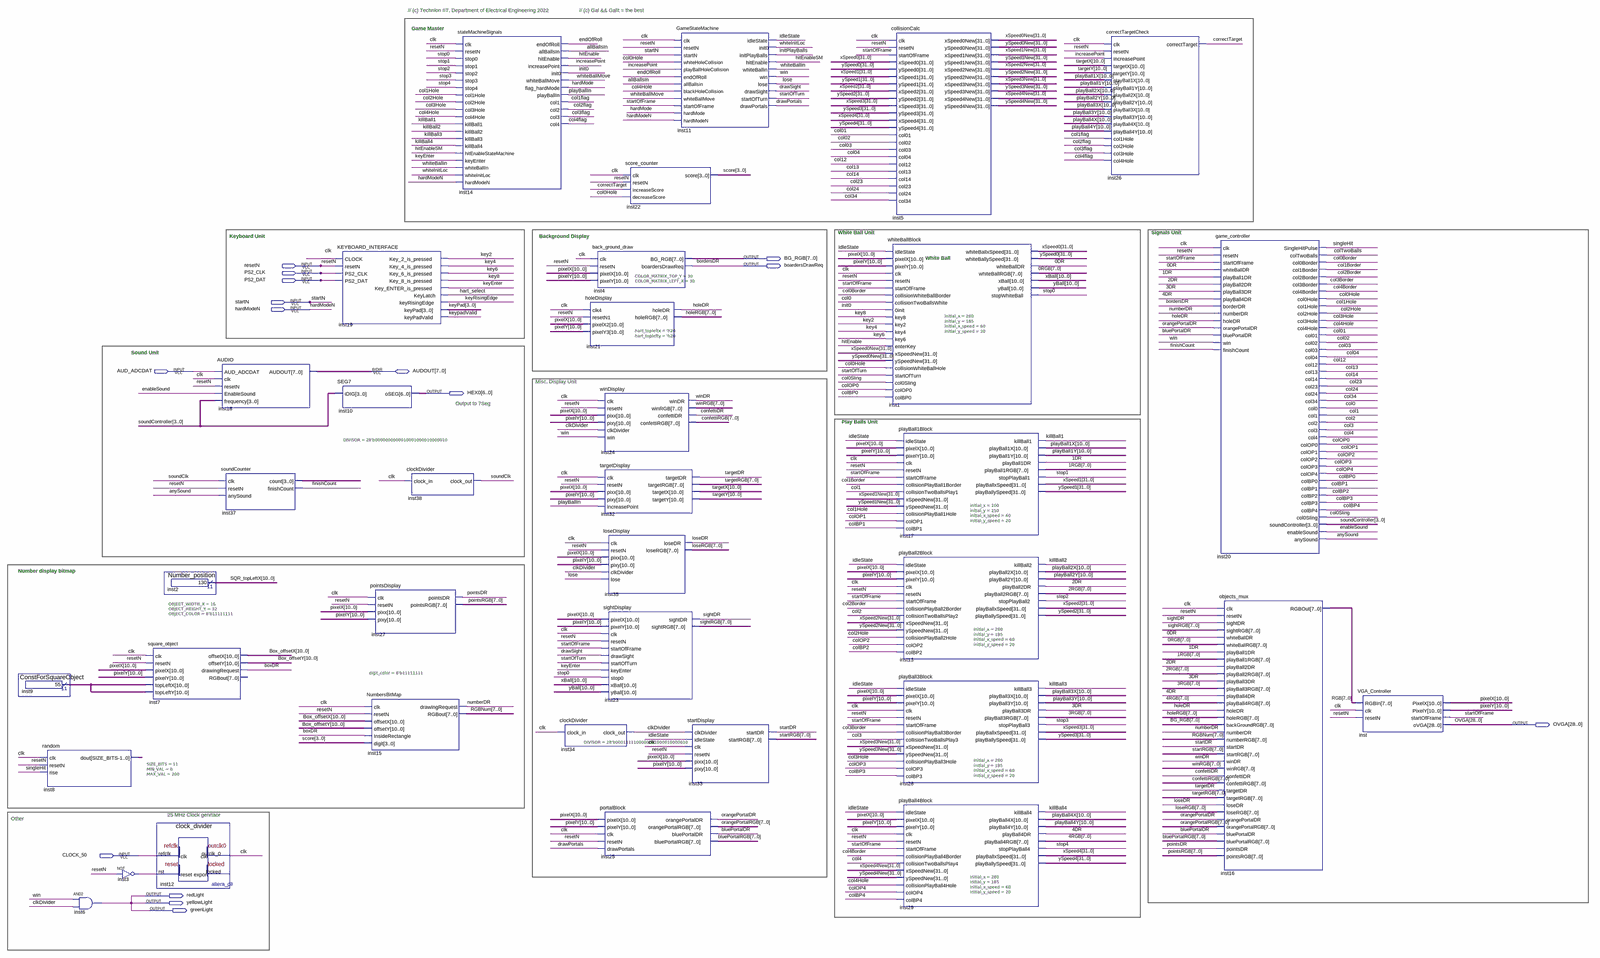
[diagram p0: schematic sheet, whole]
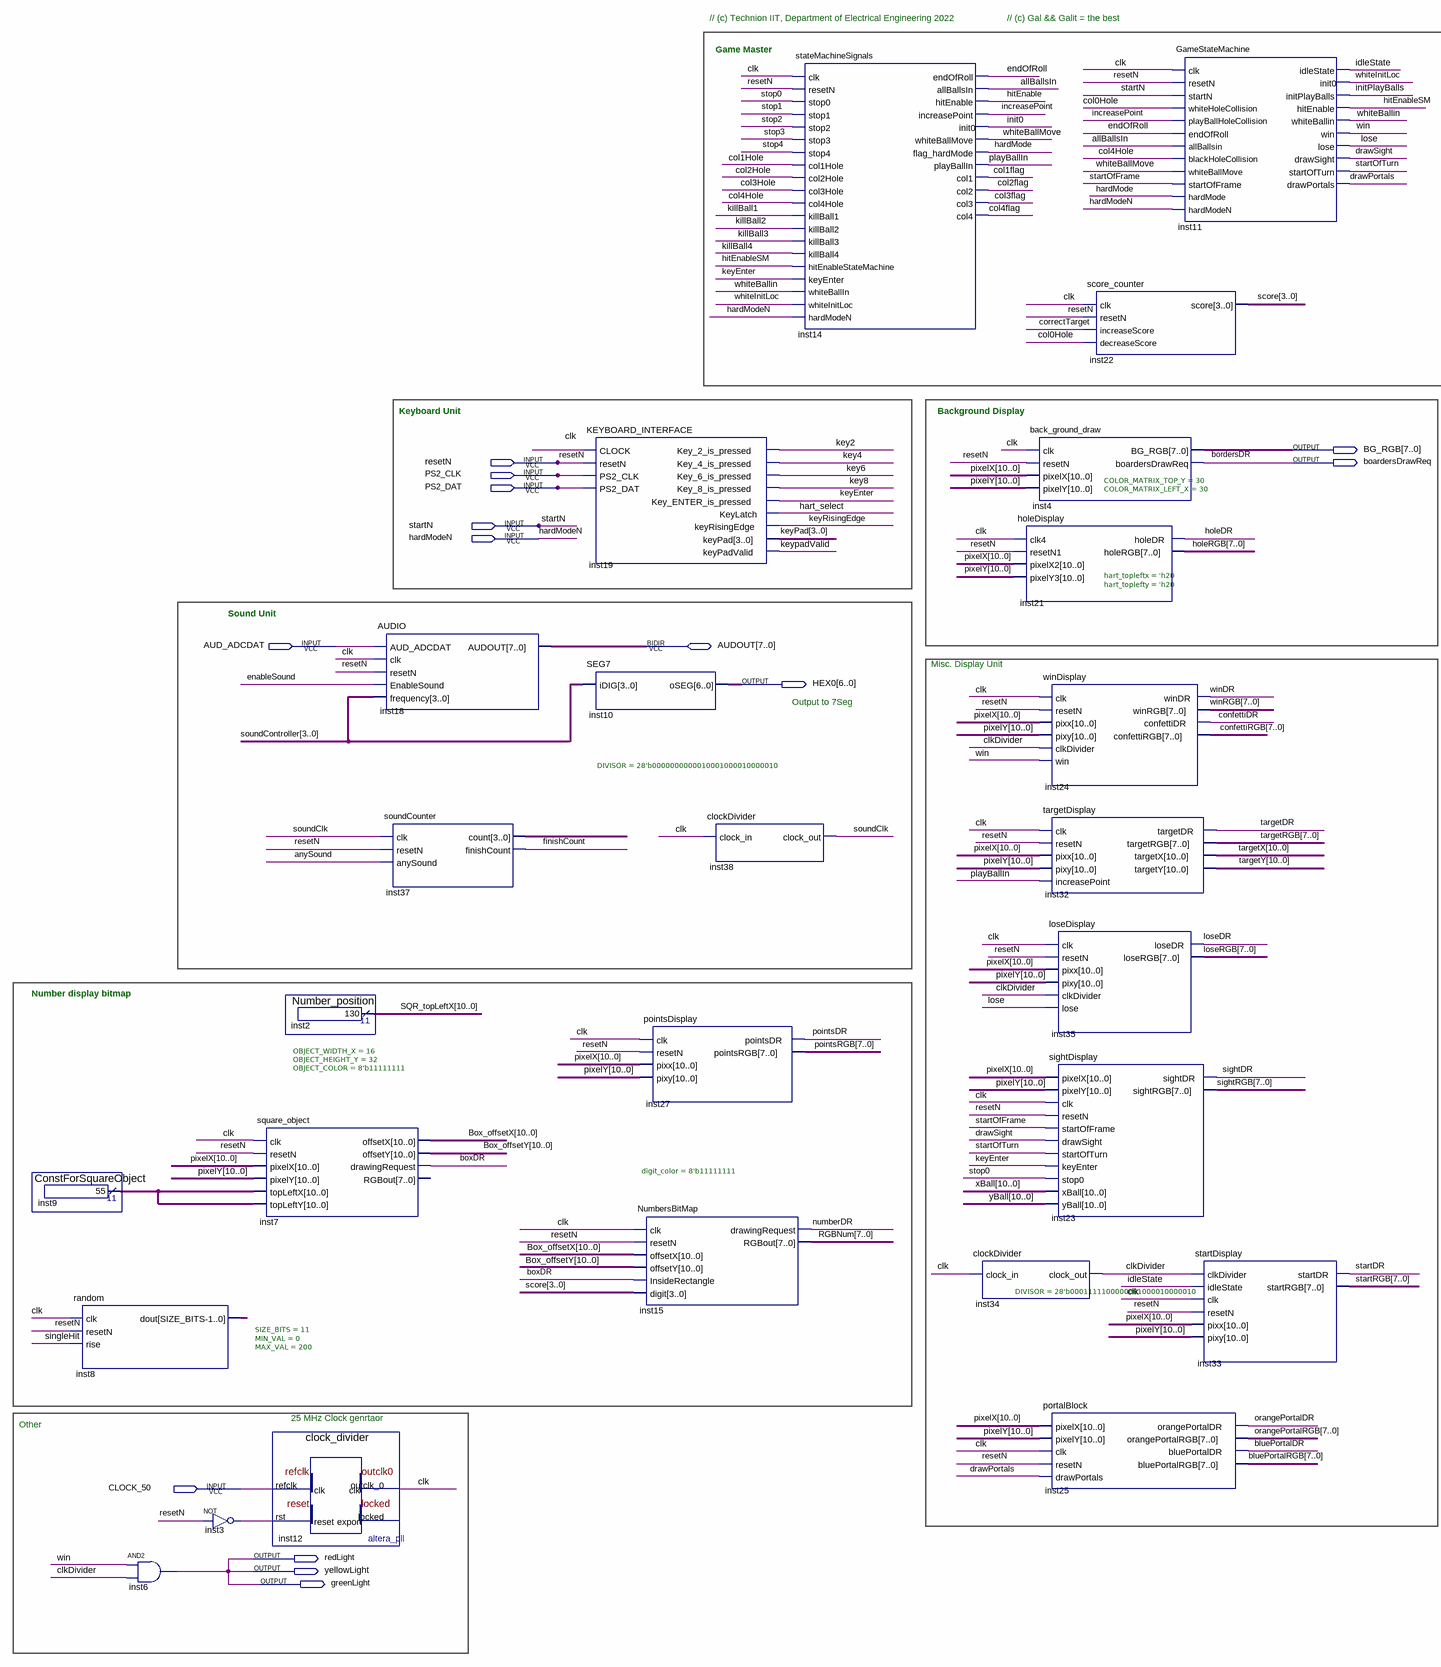
[diagram p1: schematic sheet, left part]
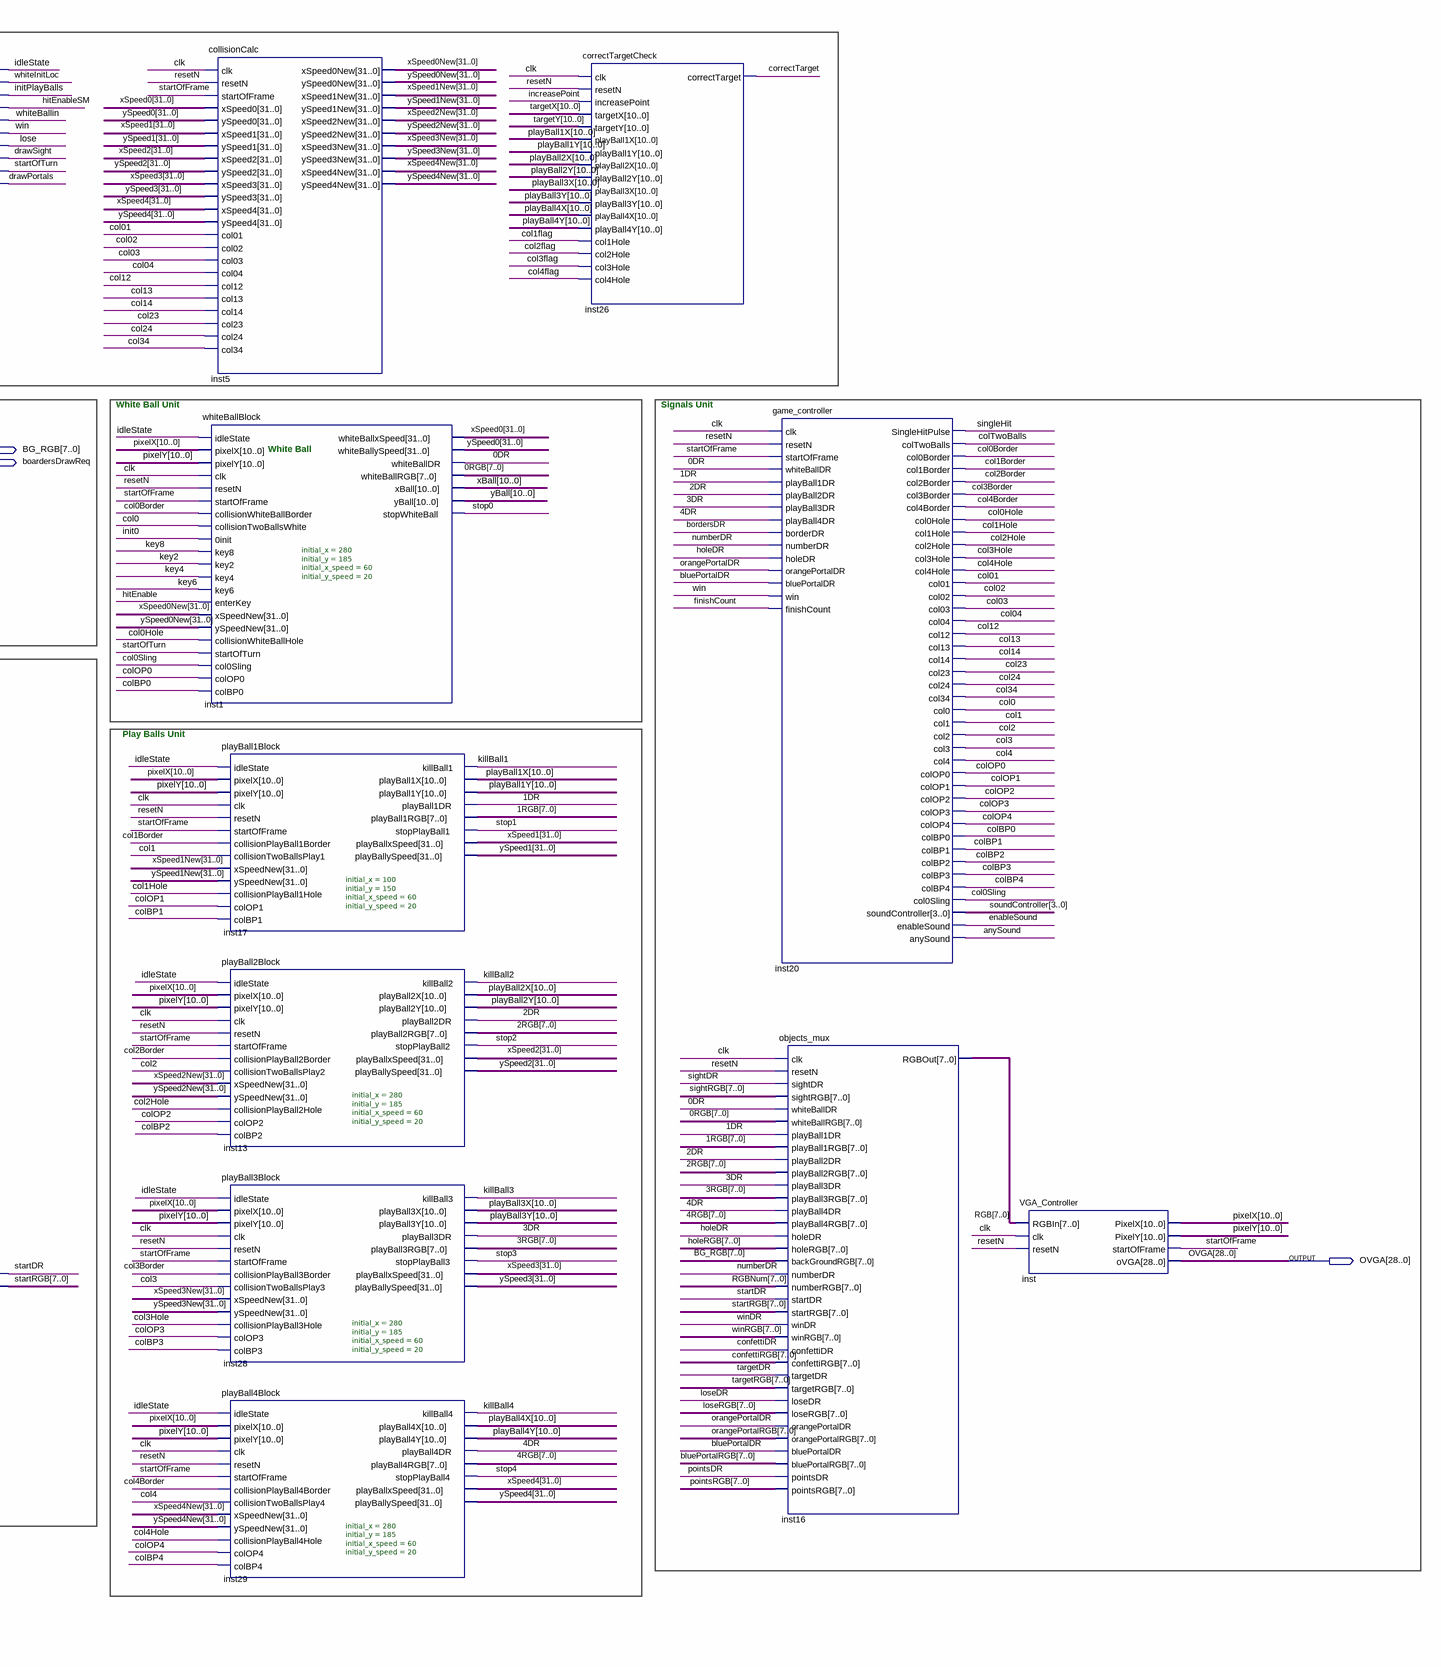
[diagram p2: schematic sheet, right part]
// Quartus schematic TOP_VGA_DEMO_KBD.bdf as structural Verilog: 36 symbols, 15 pins
module TOP_VGA_DEMO_KBD (
  input  resetN,
  input  PS2_CLK,
  input  PS2_DAT,
  input  startN,
  input  hardModeN,
  input  AUD_ADCDAT,
  input  CLOCK_50,
  inout  [7:0] AUDOUT,
  output [7:0] BG_RGB,
  output boardersDrawReq,
  output [6:0] HEX0,
  output [28:0] OVGA,
  output redLight,
  output yellowLight,
  output greenLight
);

  wire \0DR , \1DR , \2DR , \3DR , \4DR , allBallsIn, anySound, bluePortalDR, boxDR, clk, clkDivider, col0,
       col0Border, col0Hole, col0Sling, col1, col01, col1Border, col1flag, col1Hole, col02, col2, col2Border,
       col2flag, col2Hole, col03, col3, col3Border, col3flag, col3Hole, col4, col04, col4Border, col4flag,
       col4Hole, col12, col13, col14, col23, col24, col34, colBP0, colBP1, colBP2, colBP3, colBP4, colOP0,
       colOP1, colOP2, colOP3, colOP4, colTwoBalls, confettiDR, correctTarget, drawPortals, drawSight,
       enableSound, endOfRoll, finishCount, hardMode, hart_select, hitEnable, hitEnableSM, holeDR, idleState,
       increasePoint, init0, initPlayBalls, inst3_out, key2, key4, key6, key8, keyEnter, keypadValid,
       keyRisingEdge, killBall1, killBall2, killBall3, killBall4, lose, loseDR, numberDR, orangePortalDR,
       playBallIn, pointsDR, sightDR, singleHit, soundClk, startDR, startOfFrame, startOfTurn, stop0, stop1,
       stop2, stop3, stop4, targetDR, whiteBallin, whiteBallMove, whiteInitLoc, win, winDR;
  wire [3:0] inst37_count, keyPad, score, soundController;
  wire [7:0] \0RGB , \1RGB , \2RGB , \3RGB , \4RGB , bluePortalRGB, confettiRGB, holeRGB, loseRGB,
       orangePortalRGB, pointsRGB, RGB, RGBNum, sightRGB, startRGB, targetRGB, winRGB;
  wire [10:0] Box_offsetX, Box_offsetY, inst8_dout, inst9_result, pixelX, pixelY, playBall1X, playBall1Y,
       playBall2X, playBall2Y, playBall3X, playBall3Y, playBall4X, playBall4Y, SQR_topLeftX, targetX,
       targetY, xBall, yBall;
  wire [31:0] xSpeed0, xSpeed0New, xSpeed1, xSpeed1New, xSpeed2, xSpeed2New, xSpeed3, xSpeed3New, xSpeed4,
       xSpeed4New, ySpeed0, ySpeed0New, ySpeed1, ySpeed1New, ySpeed2, ySpeed2New, ySpeed3, ySpeed3New,
       ySpeed4, ySpeed4New;

  ConstForSquareObject inst9 (.result(inst9_result));
  random #(.SIZE_BITS(11), .MIN_VAL(0), .MAX_VAL(200)) inst8 (
    .clk(clk), .resetN(resetN), .rise(singleHit), .dout(inst8_dout));
  and inst6 (greenLight, win, clkDivider);
  not inst3 (inst3_out, resetN);
  square_object #(.OBJECT_WIDTH_X(16), .OBJECT_HEIGHT_Y(32), .OBJECT_COLOR(8'b11111111)) inst7 (
    .clk(clk), .resetN(resetN), .pixelX(pixelX), .pixelY(pixelY), .topLeftX(inst9_result),
    .topLeftY(inst9_result), .offsetX(Box_offsetX), .offsetY(Box_offsetY), .drawingRequest(boxDR));  // open: RGBout
  Number_position inst2 (.result(SQR_topLeftX));
  clock_divider inst12 (.refclk(CLOCK_50), .rst(inst3_out), .outclk_0(clk));  // open: locked
  AUDIO inst18 (
    .AUD_ADCDAT(AUD_ADCDAT), .clk(clk), .resetN(resetN), .EnableSound(enableSound),
    .frequency(soundController), .AUDOUT(AUDOUT));
  soundCounter inst37 (
    .clk(soundClk), .resetN(resetN), .anySound(anySound), .count(inst37_count), .finishCount(finishCount));
  KEYBOARD_INTERFACE inst19 (
    .CLOCK(clk), .resetN(resetN), .PS2_CLK(PS2_CLK), .PS2_DAT(PS2_DAT), .Key_2_is_pressed(key2),
    .Key_4_is_pressed(key4), .Key_6_is_pressed(key6), .Key_8_is_pressed(key8),
    .Key_ENTER_is_pressed(keyEnter), .KeyLatch(hart_select), .keyRisingEdge(keyRisingEdge), .keyPad(keyPad),
    .keyPadValid(keypadValid));
  SEG7 inst10 (.iDIG(soundController), .oSEG(HEX0));
  pointsDisplay inst27 (
    .clk(clk), .resetN(resetN), .pixx(pixelX), .pixy(pixelY), .pointsDR(pointsDR), .pointsRGB(pointsRGB));
  NumbersBitMap #(.digit_color(8'b11111111)) inst15 (
    .clk(clk), .resetN(resetN), .offsetX(Box_offsetX), .offsetY(Box_offsetY), .InsideRectangle(boxDR),
    .digit(score), .drawingRequest(numberDR), .RGBout(RGBNum));
  clockDivider #(.DIVISOR(28'b0000000000010001000010000010)) inst38 (.clock_in(clk), .clock_out(soundClk));
  stateMachineSignals inst14 (
    .clk(clk), .resetN(resetN), .stop0(stop0), .stop1(stop1), .stop2(stop2), .stop3(stop3), .stop4(stop4),
    .col1Hole(col1Hole), .col2Hole(col2Hole), .col3Hole(col3Hole), .col4Hole(col4Hole),
    .killBall1(killBall1), .killBall2(killBall2), .killBall3(killBall3), .killBall4(killBall4),
    .hitEnableStateMachine(hitEnableSM), .keyEnter(keyEnter), .whiteBallIn(whiteBallin),
    .whiteInitLoc(whiteInitLoc), .hardModeN(hardModeN), .endOfRoll(endOfRoll), .allBallsIn(allBallsIn),
    .hitEnable(hitEnable), .increasePoint(increasePoint), .init0(init0), .whiteBallMove(whiteBallMove),
    .flag_hardMode(hardMode), .playBallIn(playBallIn), .col1(col1flag), .col2(col2flag), .col3(col3flag),
    .col4(col4flag));
  clockDivider #(.DIVISOR(28'b0001111100000001000010000010)) inst34 (.clock_in(clk), .clock_out(clkDivider));
  back_ground_draw #(.COLOR_MATRIX_TOP_Y(30), .COLOR_MATRIX_LEFT_X(30)) inst4 (
    .clk(clk), .resetN(resetN), .pixelX(pixelX), .pixelY(pixelY), .BG_RGB(BG_RGB),
    .boardersDrawReq(boardersDrawReq));
  holeDisplay #(.hart_topleftx('h20), .hart_toplefty('h20)) inst21 (
    .clk4(clk), .resetN1(resetN), .pixelX2(pixelX), .pixelY3(pixelY), .holeDR(holeDR), .holeRGB(holeRGB));
  winDisplay inst24 (
    .clk(clk), .resetN(resetN), .pixx(pixelX), .pixy(pixelY), .clkDivider(clkDivider), .win(win),
    .winDR(winDR), .winRGB(winRGB), .confettiDR(confettiDR), .confettiRGB(confettiRGB));
  targetDisplay inst32 (
    .clk(clk), .resetN(resetN), .pixx(pixelX), .pixy(pixelY), .increasePoint(playBallIn),
    .targetDR(targetDR), .targetRGB(targetRGB), .targetX(targetX), .targetY(targetY));
  loseDisplay inst35 (
    .clk(clk), .resetN(resetN), .pixx(pixelX), .pixy(pixelY), .clkDivider(clkDivider), .lose(lose),
    .loseDR(loseDR), .loseRGB(loseRGB));
  sightDisplay inst23 (
    .pixelX(pixelX), .pixelY(pixelY), .clk(clk), .resetN(resetN), .startOfFrame(startOfFrame),
    .drawSight(drawSight), .startOfTurn(startOfTurn), .keyEnter(keyEnter), .stop0(stop0), .xBall(xBall),
    .yBall(yBall), .sightDR(sightDR), .sightRGB(sightRGB));
  portalBlock inst25 (
    .pixelX(pixelX), .pixelY(pixelY), .clk(clk), .resetN(resetN), .drawPortals(drawPortals),
    .orangePortalDR(orangePortalDR), .orangePortalRGB(orangePortalRGB), .bluePortalDR(bluePortalDR),
    .bluePortalRGB(bluePortalRGB));
  score_counter inst22 (
    .clk(clk), .resetN(resetN), .increaseScore(correctTarget), .decreaseScore(col0Hole), .score(score));
  GameStateMachine inst11 (
    .clk(clk), .resetN(resetN), .startN(startN), .whiteHoleCollision(col0Hole),
    .playBallHoleCollision(increasePoint), .endOfRoll(endOfRoll), .allBallsin(allBallsIn),
    .blackHoleCollision(col4Hole), .whiteBallMove(whiteBallMove), .startOfFrame(startOfFrame),
    .hardMode(hardMode), .hardModeN(hardModeN), .idleState(idleState), .init0(whiteInitLoc),
    .initPlayBalls(initPlayBalls), .hitEnable(hitEnableSM), .whiteBallin(whiteBallin), .win(win),
    .lose(lose), .drawSight(drawSight), .startOfTurn(startOfTurn), .drawPortals(drawPortals));
  startDisplay inst33 (
    .clkDivider(clkDivider), .idleState(idleState), .clk(clk), .resetN(resetN), .pixx(pixelX), .pixy(pixelY),
    .startDR(startDR), .startRGB(startRGB));
  collisionCalc inst5 (
    .clk(clk), .resetN(resetN), .startOfFrame(startOfFrame), .xSpeed0(xSpeed0), .ySpeed0(ySpeed0),
    .xSpeed1(xSpeed1), .ySpeed1(ySpeed1), .xSpeed2(xSpeed2), .ySpeed2(ySpeed2), .xSpeed3(xSpeed3),
    .ySpeed3(ySpeed3), .xSpeed4(xSpeed4), .ySpeed4(ySpeed4), .col01(col01), .col02(col02), .col03(col03),
    .col04(col04), .col12(col12), .col13(col13), .col14(col14), .col23(col23), .col24(col24), .col34(col34),
    .xSpeed0New(xSpeed0New), .ySpeed0New(ySpeed0New), .xSpeed1New(xSpeed1New), .ySpeed1New(ySpeed1New),
    .xSpeed2New(xSpeed2New), .ySpeed2New(ySpeed2New), .xSpeed3New(xSpeed3New), .ySpeed3New(ySpeed3New),
    .xSpeed4New(xSpeed4New), .ySpeed4New(ySpeed4New));
  whiteBallBlock #(.initial_x(280), .initial_y(185), .initial_x_speed(60), .initial_y_speed(20)) inst1 (
    .idleState(idleState), .pixelX(pixelX), .pixelY(pixelY), .clk(clk), .resetN(resetN),
    .startOfFrame(startOfFrame), .collisionWhiteBallBorder(col0Border), .collisionTwoBallsWhite(col0),
    .\0init (init0), .key8(key8), .key2(key2), .key4(key4), .key6(key6), .enterKey(hitEnable),
    .xSpeedNew(xSpeed0New), .ySpeedNew(ySpeed0New), .collisionWhiteBallHole(col0Hole),
    .startOfTurn(startOfTurn), .col0Sling(col0Sling), .colOP0(colOP0), .colBP0(colBP0),
    .whiteBallxSpeed(xSpeed0), .whiteBallySpeed(ySpeed0), .whiteBallDR(\0DR ), .whiteBallRGB(\0RGB ),
    .xBall(xBall), .yBall(yBall), .stopWhiteBall(stop0));
  playBall1Block #(.initial_x(100), .initial_y(150), .initial_x_speed(60), .initial_y_speed(20)) inst17 (
    .idleState(idleState), .pixelX(pixelX), .pixelY(pixelY), .clk(clk), .resetN(resetN),
    .startOfFrame(startOfFrame), .collisionPlayBall1Border(col1Border), .collisionTwoBallsPlay1(col1),
    .xSpeedNew(xSpeed1New), .ySpeedNew(ySpeed1New), .collisionPlayBall1Hole(col1Hole), .colOP1(colOP1),
    .colBP1(colBP1), .killBall1(killBall1), .playBall1X(playBall1X), .playBall1Y(playBall1Y),
    .playBall1DR(\1DR ), .playBall1RGB(\1RGB ), .stopPlayBall1(stop1), .playBallxSpeed(xSpeed1),
    .playBallySpeed(ySpeed1));
  playBall2Block #(.initial_x(280), .initial_y(185), .initial_x_speed(60), .initial_y_speed(20)) inst13 (
    .idleState(idleState), .pixelX(pixelX), .pixelY(pixelY), .clk(clk), .resetN(resetN),
    .startOfFrame(startOfFrame), .collisionPlayBall2Border(col2Border), .collisionTwoBallsPlay2(col2),
    .xSpeedNew(xSpeed2New), .ySpeedNew(ySpeed2New), .collisionPlayBall2Hole(col2Hole), .colOP2(colOP2),
    .colBP2(colBP2), .killBall2(killBall2), .playBall2X(playBall2X), .playBall2Y(playBall2Y),
    .playBall2DR(\2DR ), .playBall2RGB(\2RGB ), .stopPlayBall2(stop2), .playBallxSpeed(xSpeed2),
    .playBallySpeed(ySpeed2));
  playBall3Block #(.initial_x(280), .initial_y(185), .initial_x_speed(60), .initial_y_speed(20)) inst28 (
    .idleState(idleState), .pixelX(pixelX), .pixelY(pixelY), .clk(clk), .resetN(resetN),
    .startOfFrame(startOfFrame), .collisionPlayBall3Border(col3Border), .collisionTwoBallsPlay3(col3),
    .xSpeedNew(xSpeed3New), .ySpeedNew(ySpeed3New), .collisionPlayBall3Hole(col3Hole), .colOP3(colOP3),
    .colBP3(colBP3), .killBall3(killBall3), .playBall3X(playBall3X), .playBall3Y(playBall3Y),
    .playBall3DR(\3DR ), .playBall3RGB(\3RGB ), .stopPlayBall3(stop3), .playBallxSpeed(xSpeed3),
    .playBallySpeed(ySpeed3));
  playBall4Block #(.initial_x(280), .initial_y(185), .initial_x_speed(60), .initial_y_speed(20)) inst29 (
    .idleState(idleState), .pixelX(pixelX), .pixelY(pixelY), .clk(clk), .resetN(resetN),
    .startOfFrame(startOfFrame), .collisionPlayBall4Border(col4Border), .collisionTwoBallsPlay4(col4),
    .xSpeedNew(xSpeed4New), .ySpeedNew(ySpeed4New), .collisionPlayBall4Hole(col4Hole), .colOP4(colOP4),
    .colBP4(colBP4), .killBall4(killBall4), .playBall4X(playBall4X), .playBall4Y(playBall4Y),
    .playBall4DR(\4DR ), .playBall4RGB(\4RGB ), .stopPlayBall4(stop4), .playBallxSpeed(xSpeed4),
    .playBallySpeed(ySpeed4));
  correctTargetCheck inst26 (
    .clk(clk), .resetN(resetN), .increasePoint(increasePoint), .targetX(targetX), .targetY(targetY),
    .playBall1X(playBall1X), .playBall1Y(playBall1Y), .playBall2X(playBall2X), .playBall2Y(playBall2Y),
    .playBall3X(playBall3X), .playBall3Y(playBall3Y), .playBall4X(playBall4X), .playBall4Y(playBall4Y),
    .col1Hole(col1flag), .col2Hole(col2flag), .col3Hole(col3flag), .col4Hole(col4flag),
    .correctTarget(correctTarget));
  game_controller inst20 (
    .clk(clk), .resetN(resetN), .startOfFrame(startOfFrame), .whiteBallDR(\0DR ), .playBall1DR(\1DR ),
    .playBall2DR(\2DR ), .playBall3DR(\3DR ), .playBall4DR(\4DR ), .borderDR(boardersDrawReq),
    .numberDR(numberDR), .holeDR(holeDR), .orangePortalDR(orangePortalDR), .bluePortalDR(bluePortalDR),
    .win(win), .finishCount(finishCount), .SingleHitPulse(singleHit), .colTwoBalls(colTwoBalls),
    .col0Border(col0Border), .col1Border(col1Border), .col2Border(col2Border), .col3Border(col3Border),
    .col4Border(col4Border), .col0Hole(col0Hole), .col1Hole(col1Hole), .col2Hole(col2Hole),
    .col3Hole(col3Hole), .col4Hole(col4Hole), .col01(col01), .col02(col02), .col03(col03), .col04(col04),
    .col12(col12), .col13(col13), .col14(col14), .col23(col23), .col24(col24), .col34(col34), .col0(col0),
    .col1(col1), .col2(col2), .col3(col3), .col4(col4), .colOP0(colOP0), .colOP1(colOP1), .colOP2(colOP2),
    .colOP3(colOP3), .colOP4(colOP4), .colBP0(colBP0), .colBP1(colBP1), .colBP2(colBP2), .colBP3(colBP3),
    .colBP4(colBP4), .col0Sling(col0Sling), .soundController(soundController), .enableSound(enableSound),
    .anySound(anySound));
  objects_mux inst16 (
    .clk(clk), .resetN(resetN), .sightDR(sightDR), .sightRGB(sightRGB), .whiteBallDR(\0DR ),
    .whiteBallRGB(\0RGB ), .playBall1DR(\1DR ), .playBall1RGB(\1RGB ), .playBall2DR(\2DR ),
    .playBall2RGB(\2RGB ), .playBall3DR(\3DR ), .playBall3RGB(\3RGB ), .playBall4DR(\4DR ),
    .playBall4RGB(\4RGB ), .holeDR(holeDR), .holeRGB(holeRGB), .backGroundRGB(BG_RGB), .numberDR(numberDR),
    .numberRGB(RGBNum), .startDR(startDR), .startRGB(startRGB), .winDR(winDR), .winRGB(winRGB),
    .confettiDR(confettiDR), .confettiRGB(confettiRGB), .targetDR(targetDR), .targetRGB(targetRGB),
    .loseDR(loseDR), .loseRGB(loseRGB), .orangePortalDR(orangePortalDR), .orangePortalRGB(orangePortalRGB),
    .bluePortalDR(bluePortalDR), .bluePortalRGB(bluePortalRGB), .pointsDR(pointsDR), .pointsRGB(pointsRGB),
    .RGBOut(RGB));
  VGA_Controller inst (
    .RGBIn(RGB), .clk(clk), .resetN(resetN), .PixelX(pixelX), .PixelY(pixelY), .startOfFrame(startOfFrame),
    .oVGA(OVGA));

  assign redLight = greenLight;
  assign yellowLight = greenLight;

  // Other names for the same wires on the sheet: bordersDR = boardersDrawReq

  // Notes on the sheet:
  //   // (c) Technion IIT, Department of Electrical Engineering 2022
  //   // (c) Gal && Galit = the best
  //   Game Master
  //   White Ball Unit
  //   Signals Unit
  //   Keyboard Unit
  //   Background Display
  //   White Ball
  //   Sound Unit
  //   Misc. Display Unit
  //   Output to 7Seg
  //   Play Balls Unit
  //   Number display bitmap
  //   25 MHz Clock genrtaor
  //   Other
endmodule
